# Altium project YNM-3000-1.PrjPCB
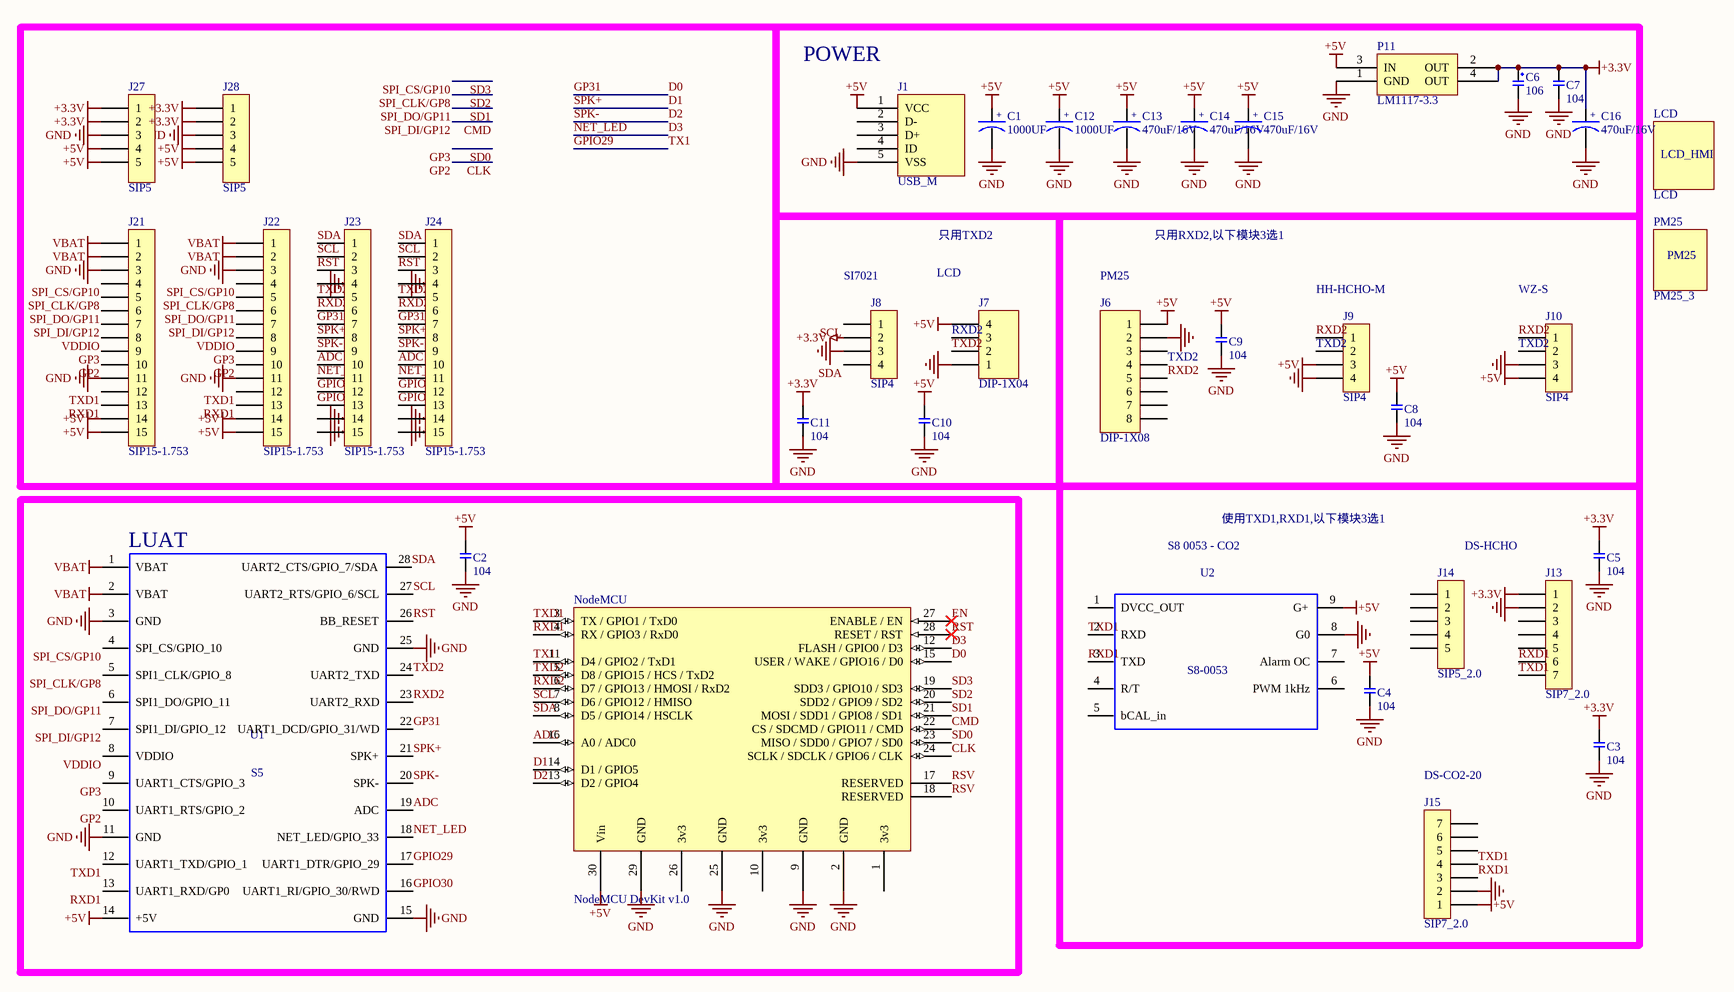
[diagram p0: YNM-3000-1.SchDoc]
1 sheet, 37 parts. Net scope: global (net labels, ports and power ports of the same name join across sheets).
Board file: YNM-3000-1.PcbDoc

## Sheet YNM-3000-1.SchDoc: LW-AirKit-A
size A3; Time: 201711

### Parts
C1  1000UF  [SMD-EC-F10]
C2  104  [CAP-SMD-0603]
C3  104  [CAP-SMD-0603]
C4  104  [CAP-SMD-0603]
C5  104  [CAP-SMD-0603]
C6  106  [EC3528B]
C7  104  [CAP-SMD-0603]
C8  104  [CAP-SMD-0603]
C9  104  [CAP-SMD-0603]
C10  104  [CAP-SMD-0603]
C11  104  [CAP-SMD-0603]
C12  1000UF  [SMD-EC-F10]
C13  470uF/16V  [SMD-EC-F8]
C14  470uF/16V  [SMD-EC-F8]
C15  470uF/16V  [SMD-EC-F8]
C16  470uF/16V  [SMD-EC-F8]
J1  USB_M  [USB_MICRO]
J6  DIP-1X08  [1.27*8]
J7  DIP-1X04  [XH-1X04-2.5]
J8  SIP4  [DB-1X4]
J9  SIP4  [DB-1X4]
J10  SIP4  [DB-1X4]
J13  SIP7_2.0  [SIP_2.0_7P]
J14  SIP5_2.0  [SIP_2.0_5P]
J15  SIP7_2.0  [SIP_2.0_7P]
J21  SIP15-1.753  [DB-1X15-1.753]
J22  SIP15-1.753  [DB-1X15-1.753]
J23  SIP15-1.753  [DB-1X15-1.753]
J24  SIP15-1.753  [DB-1X15-1.753]
J27  SIP5  [DB-1X5]
J28  SIP5  [DB-1X5]
LCD  LCD  [LCD]
NodeMCU  NodeMCU DevKit v1.0  [NodeMCU DevKit v1.0 - Inside Labels]
P11  LM1117-3.3  [SOT-223]
PM25  PM25_3  [PM25_3]
U1  S5  [S5]
U2  S8-0053  [S8-0053]

### Blocks framed on the sheet
POWER: C1 C6 C7 C12-C16 J1 P11
LUAT: C2 NodeMCU U1

### Nets
+3.3V: C3.2 C5.2 C6.1 C7.2 C11.2 C16.1 J8.2 J13.1 J27.1 J27.2 J28.1 J28.2 P11.2(OUT) P11.4(OUT)
+5V: C1.1 C2.2 C4.2 C8.2 C9.2 C10.2 C12.1 C13.1 C14.1 C15.1 J1.1(VCC) J6.1 J7.4 J9.3 J10.4 J15.1 J21.14 J21.15 J22.14 J22.15 J27.4 J27.5 J28.4 J28.5 NodeMCU.30(Vin) P11.3(IN) U1.14(+5V) U2.9(G+)
GND: C1.2 C2.1 C3.1 C4.1 C5.1 C6.2 C7.1 C8.1 C9.1 C10.1 C11.1 C12.2 C13.2 C14.2 C15.2 C16.2 J1.5(VSS) J6.2 J7.1 J8.3 J9.4 J10.3 J13.2 J15.2 J21.3 J21.11 J22.3 J22.11 J23.4 J23.14 J23.15 J24.4 J24.14 J24.15 J27.3 J28.3 NodeMCU.2(GND) NodeMCU.9(GND) NodeMCU.25(GND) NodeMCU.29(GND) P11.1(GND) U1.3(GND) U1.11(GND) U1.15(GND) U1.25(GND) U2.8(G0)
VBAT: J21.1 J21.2 J22.1 J22.2 U1.1(VBAT) U1.2(VBAT)
ADC: J23.10 J24.10 NodeMCU.16(A0_/_ADC0) U1.19(ADC)
CLK: J21.10 J22.10 NodeMCU.24(SCLK_/_SDCLK_/_GPIO6_/_CLK) U1.10(UART1_RTS/GPIO_2)  [also labelled GP2]
CMD: J21.7 J22.7 NodeMCU.22(CS_/_SDCMD_/_GPIO11_/_CMD) U1.7(SPI1_DI/GPIO_12)  [also labelled SPI_DI/GP12]
D0: J23.7 J24.7 NodeMCU.15(USER_/_WAKE_/_GPIO16_/_D0) U1.22(UART1_DCD/GPIO_31/WD)  [also labelled GP31]
D1: J23.8 J24.8 NodeMCU.14(D1_/_GPIO5) U1.21(SPK+)  [also labelled SPK+]
D2: J23.9 J24.9 NodeMCU.13(D2_/_GPIO4) U1.20(SPK-)  [also labelled SPK-]
D3: J23.11 J24.11 NodeMCU.12(FLASH_/_GPIO0_/_D3) U1.18(NET_LED/GPIO_33)  [also labelled NET_LED]
EN: NodeMCU.27(ENABLE_/_EN)
GP3: J21.9 J22.9 NodeMCU.23(MISO_/_SDD0_/_GPIO7_/_SD0) U1.9(UART1_CTS/GPIO_3)  [also labelled SD0]
GPIO29: J23.12 J24.12 NodeMCU.11(D4_/_GPIO2_/_TxD1) U1.17(UART1_DTR/GPIO_29)  [also labelled TX1]
GPIO30: J23.13 J24.13 U1.16(UART1_RI/GPIO_30/RWD)
RST: J23.3 J24.3 NodeMCU.28(RESET_/_RST) U1.26(BB_RESET)
RSV: NodeMCU.17(RESERVED) NodeMCU.18(RESERVED)
RXD1: J13.6 J15.3 J21.13 J22.13 NodeMCU.4(RX_/_GPIO3_/_RxD0) U1.13(UART1_RXD/GP0) U2.3(TXD)
RXD2: J6.5 J9.1 J10.1 J23.6 J24.6 NodeMCU.6(D7_/_GPIO13_/_HMOSI_/_RxD2) U1.23(UART2_RXD)
SCL: J8.1 J23.2 J24.2 NodeMCU.7(D6_/_GPIO12_/_HMISO) U1.27(UART2_RTS/GPIO_6/SCL)
SD1: J21.6 J22.6 NodeMCU.21(MOSI_/_SDD1_/_GPIO8_/_SD1) U1.6(SPI1_DO/GPIO_11)  [also labelled SPI_DO/GP11]
SD2: J21.5 J22.5 NodeMCU.20(SDD2_/_GPIO9_/_SD2) U1.5(SPI1_CLK/GPIO_8)  [also labelled SPI_CLK/GP8]
SD3: J21.4 J22.4 NodeMCU.19(SDD3_/_GPIO10_/_SD3) U1.4(SPI_CS/GPIO_10)  [also labelled SPI_CS/GP10]
SDA: J8.4 J23.1 J24.1 NodeMCU.8(D5_/_GPIO14_/_HSCLK) U1.28(UART2_CTS/GPIO_7/SDA)
TXD1: J13.7 J15.4 J21.12 J22.12 NodeMCU.3(TX_/_GPIO1_/_TxD0) U1.12(UART1_TXD/GPIO_1) U2.2(RXD)
TXD2: J7.2 J23.5 J24.5 NodeMCU.5(D8_/_GPIO15_/_HCS_/_TxD2) U1.24(UART2_TXD)
VDDIO: J21.8 J22.8 U1.8(VDDIO)

Not connected (* = marked no-connect by the designer): J1 2(D-) 3(D+) 4(ID); J6 3 4 6 7 8; J7 3; J9 2; J10 2; J13 3 4 5; J14 1 2 3 4 5; J15 5 6 7; NodeMCU 1(3v3) 10(3v3) 26(3v3); U2 1(DVCC_OUT) 4(R/T) 5(bCAL_in) 6(PWM_1kHz) 7(Alarm_OC)

### Notes on the sheet
- 只用TXD2
- 只用RXD2,以下模块3选1
- (near J8) SI7021
- (near J7) LCD
- (near J6) PM25
- (near J9) HH-HCHO-M
- (near J10) WZ-S
- (near J7) RXD2
- TXD2
- (near J9) TXD2
- (near J10) TXD2
- S8 0053 - CO2
- 使用TXD1,RXD1,以下模块3选1
- DS-HCHO
- (near J15) DS-CO2-20
- (in symbol LCD) LCD_HMI
- (in symbol SMD-EC-F8) +
- (in symbol SMD-EC-F10) +

### Library data of the parts
C1 C12 = SMD-EC-F10: 体积（10*10.2MM）
C2-C5 C7-C11 = Cap0603
C6 = CAP-3528
C13-C16 = SMD-EC-F8: 体积（8*10.2MM）
J1 = USB_M: Micro/Mini USB
J6 = DIP-1X08: Header, 8-Pin; LatestRevisionDate: 17-Jul-2002; LatestRevisionNote: Re-released for DXP Platform.; Publisher: Altium Limited
J7 = DIP-1X04: Header, 4-Pin; LatestRevisionDate: 17-Jul-2002; LatestRevisionNote: Re-released for DXP Platform.; Publisher: Altium Limited
P11 = LM1117
U1 = S5: Geometry.Height: 12 mm; PCB DECAL: S6
U2 = S8-0053: Geometry.Height: 12 mm; PCB DECAL: S6